# Altium schematic sheet Illustrations 2.SchDoc: Illustrations 2
size A3; ApprovedBy: LD Stanton; Author: LD Stanton; CompanyName: University of Cape Town; DrawnBy: Lawrence Stanton; Engineer: Lawrence Stanton; Organization: University of Cape Town; Address1: Department of Electrical Engineering; Address2: Rondebosch; Address3: Cape Town; Address4: South Africa 7701; DocumentNumber: 19; SheetNumber: 19; SheetTotal: 20
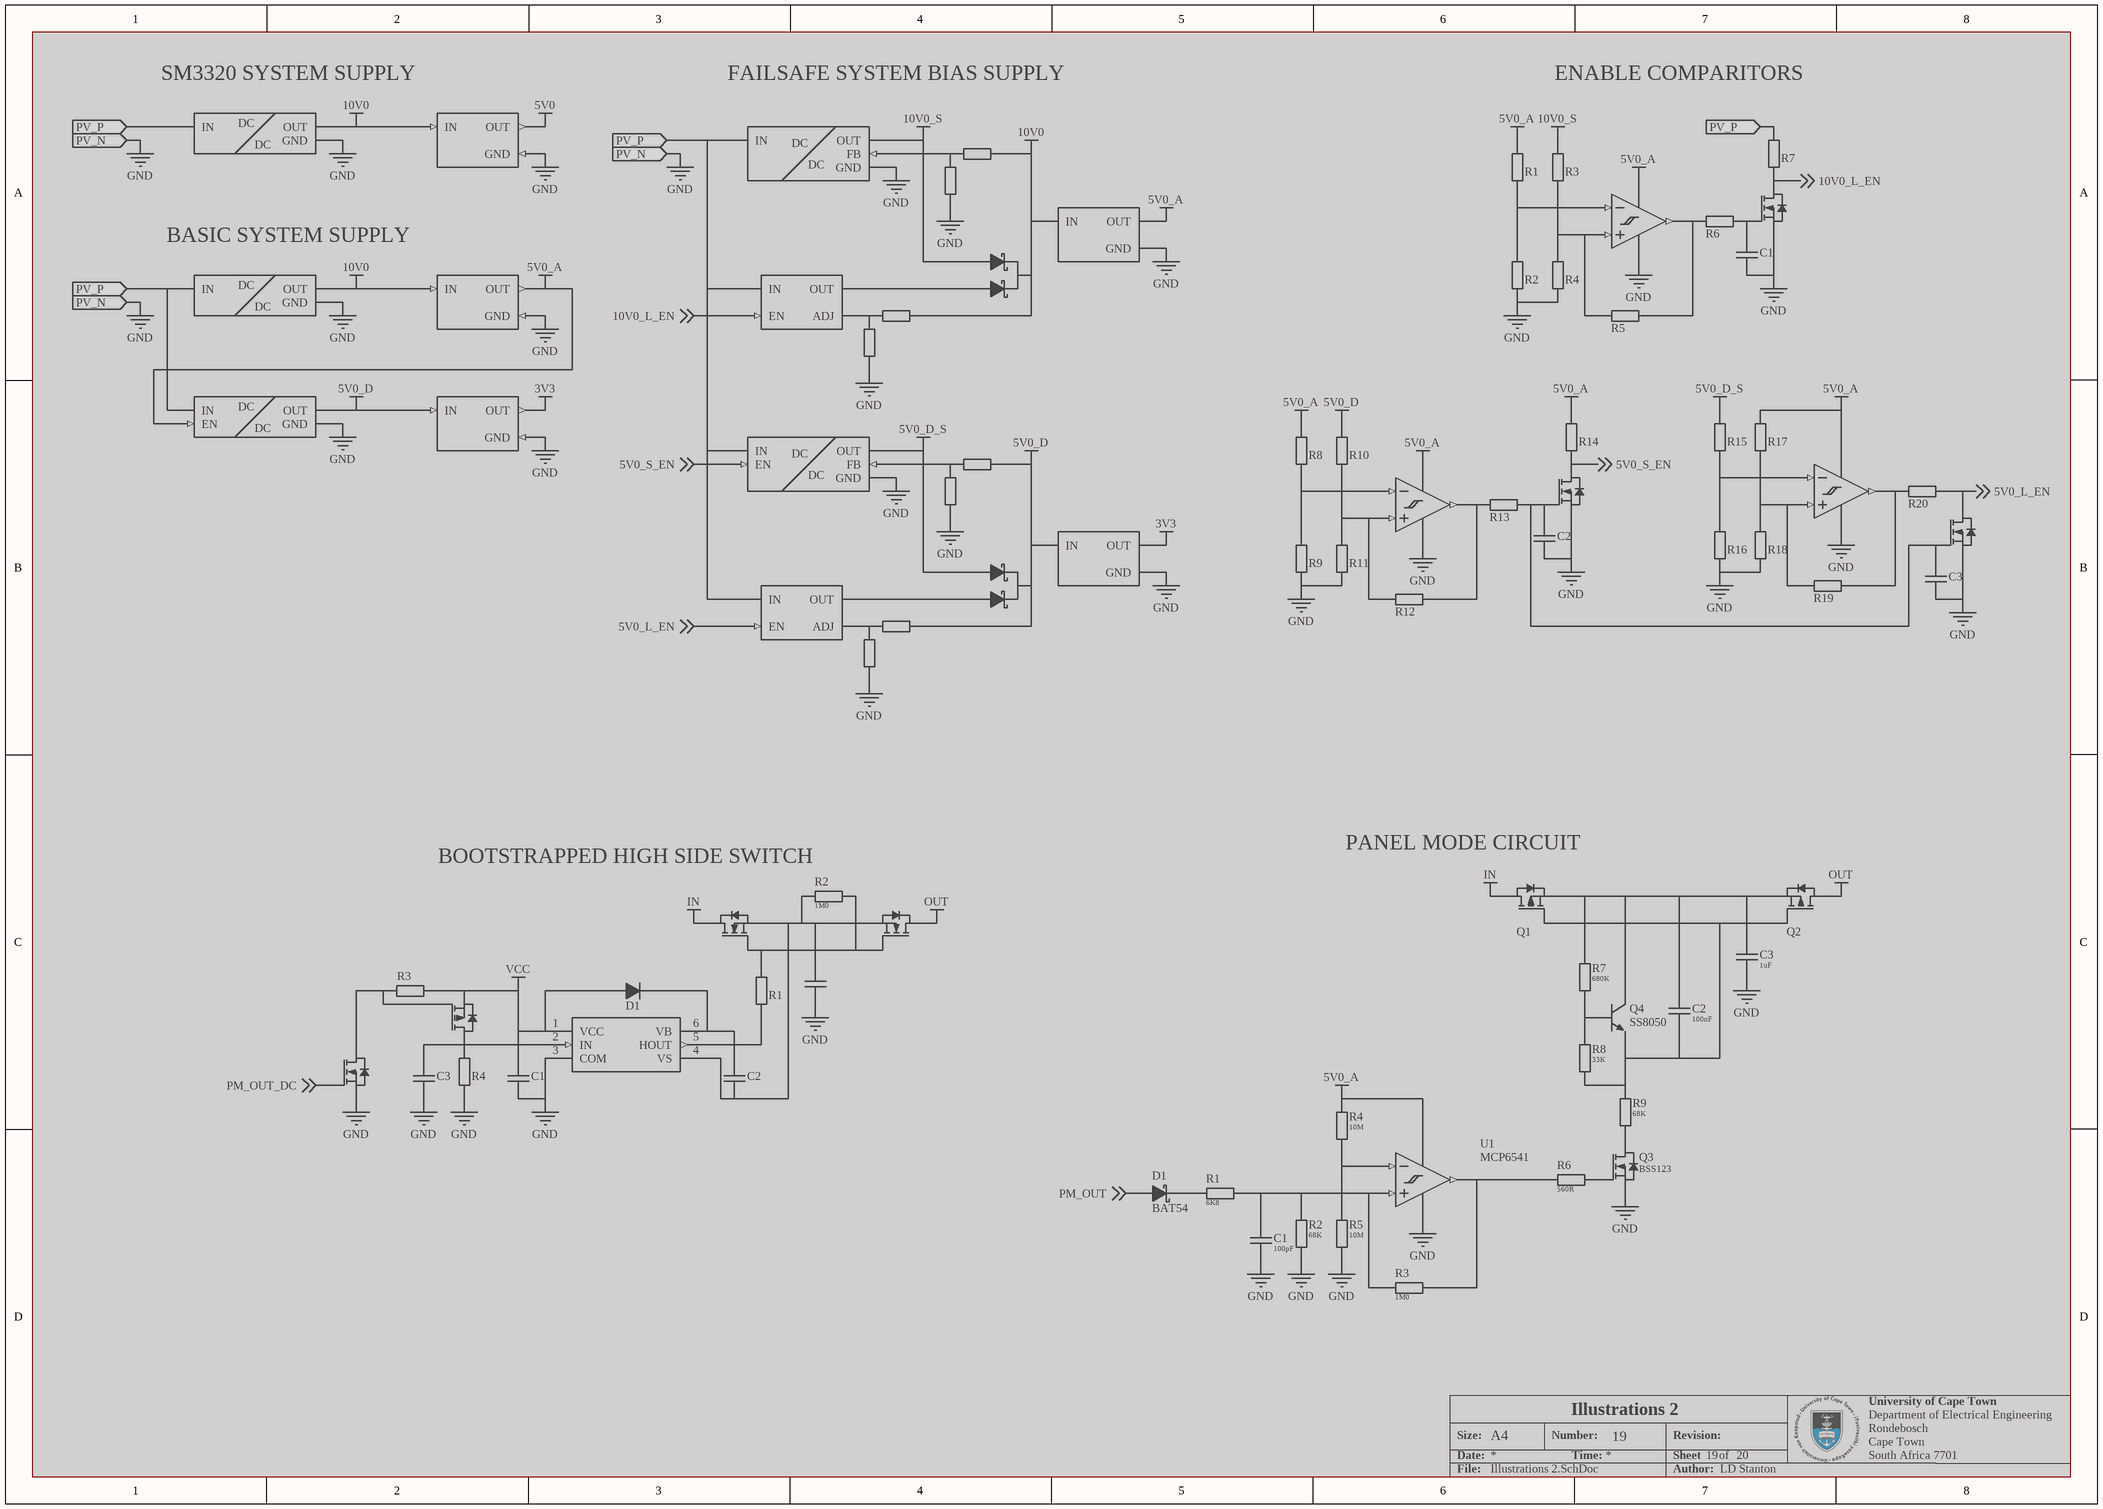
[diagram p0: Illustrations 2.SchDoc]

## Parts
(Parts that share a designator on the sheet are numbered #1, #2 ... from top to bottom, then left to right.)
C1#1  Capacitor Non-Polarised Illustration  (value not drawn)  (graphical)  (masked out: inside a compile mask, not in the netlist)
C1#2  Capacitor Non-Polarised Illustration  (value not drawn)  (graphical)  (masked out: inside a compile mask, not in the netlist)
C1#3  value 100pF  (hidden comment: Capacitor Non-Polarised Illustration)  (graphical)  (masked out: inside a compile mask, not in the netlist)
C2#1  Capacitor Non-Polarised Illustration  (value not drawn)  (graphical)  (masked out: inside a compile mask, not in the netlist)
C2#2  value 100nF  (hidden comment: Capacitor Non-Polarised Illustration)  (graphical)  (masked out: inside a compile mask, not in the netlist)
C2#3  Capacitor Non-Polarised Illustration  (value not drawn)  (graphical)  (masked out: inside a compile mask, not in the netlist)
C3#1  Capacitor Non-Polarised Illustration  (value not drawn)  (graphical)  (masked out: inside a compile mask, not in the netlist)
C3#2  value 1uF  (hidden comment: Capacitor Non-Polarised Illustration)  (graphical)  (masked out: inside a compile mask, not in the netlist)
C3#3  Capacitor Non-Polarised Illustration  (value not drawn)  (graphical)  (masked out: inside a compile mask, not in the netlist)
C3#4  Capacitor Non-Polarised Illustration  (value not drawn)  (graphical)  (masked out: inside a compile mask, not in the netlist)
D1#1  Diode Illustration  (value not drawn)  (graphical)  (masked out: inside a compile mask, not in the netlist)
D1#2  BAT54  (graphical)  (masked out: inside a compile mask, not in the netlist)
D?#1  Schottky Dual Common Cathode Illustration  (value not drawn)  (graphical)  (masked out: inside a compile mask, not in the netlist)
D?#2  Schottky Dual Common Cathode Illustration  (value not drawn)  (graphical)  (masked out: inside a compile mask, not in the netlist)
Q1  MOSFET P-Channel Illustration  (value not drawn)  (graphical)  (masked out: inside a compile mask, not in the netlist)
Q2  MOSFET P-Channel Illustration  (value not drawn)  (graphical)  (masked out: inside a compile mask, not in the netlist)
Q3  BSS123  (graphical)  (masked out: inside a compile mask, not in the netlist)
Q4  SS8050  (graphical)  (masked out: inside a compile mask, not in the netlist)
Q?#1  MOSFET N-Channel Illustration  (value not drawn)  (graphical)  (masked out: inside a compile mask, not in the netlist)
Q?#2  MOSFET N-Channel Illustration  (value not drawn)  (graphical)  (masked out: inside a compile mask, not in the netlist)
Q?#3  MOSFET N-Channel Illustration  (value not drawn)  (graphical)  (masked out: inside a compile mask, not in the netlist)
Q?#4  MOSFET N-Channel Illustration  (value not drawn)  (graphical)  (masked out: inside a compile mask, not in the netlist)
Q?#5  MOSFET N-Channel Illustration  (value not drawn)  (graphical)  (masked out: inside a compile mask, not in the netlist)
Q?#6  MOSFET P-Channel Illustration  (value not drawn)  (graphical)  (masked out: inside a compile mask, not in the netlist)
Q?#7  MOSFET N-Channel Illustration  (value not drawn)  (graphical)  (masked out: inside a compile mask, not in the netlist)
R1#1  Resistor Box Illustration  (value not drawn)  (graphical)  (masked out: inside a compile mask, not in the netlist)
R1#2  Resistor Box Illustration  (value not drawn)  (graphical)  (masked out: inside a compile mask, not in the netlist)
R1#3  value 6K8  (hidden comment: Resistor Box Illustration)  (graphical)  (masked out: inside a compile mask, not in the netlist)
R2#1  Resistor Box Illustration  (value not drawn)  (graphical)  (masked out: inside a compile mask, not in the netlist)
R2#2  value 1M0  (hidden comment: Resistor Box Illustration)  (graphical)  (masked out: inside a compile mask, not in the netlist)
R2#3  value 68K  (hidden comment: Resistor Box Illustration)  (graphical)  (masked out: inside a compile mask, not in the netlist)
R3#1  Resistor Box Illustration  (value not drawn)  (graphical)  (masked out: inside a compile mask, not in the netlist)
R3#2  Resistor Box Illustration  (value not drawn)  (graphical)  (masked out: inside a compile mask, not in the netlist)
R3#3  value 1M0  (hidden comment: Resistor Box Illustration)  (graphical)  (masked out: inside a compile mask, not in the netlist)
R4#1  Resistor Box Illustration  (value not drawn)  (graphical)  (masked out: inside a compile mask, not in the netlist)
R4#2  Resistor Box Illustration  (value not drawn)  (graphical)  (masked out: inside a compile mask, not in the netlist)
R4#3  value 10M  (hidden comment: Resistor Box Illustration)  (graphical)  (masked out: inside a compile mask, not in the netlist)
R5#1  Resistor Box Illustration  (value not drawn)  (graphical)  (masked out: inside a compile mask, not in the netlist)
R5#2  value 10M  (hidden comment: Resistor Box Illustration)  (graphical)  (masked out: inside a compile mask, not in the netlist)
R6#1  Resistor Box Illustration  (value not drawn)  (graphical)  (masked out: inside a compile mask, not in the netlist)
R6#2  value 560R  (hidden comment: Resistor Box Illustration)  (graphical)  (masked out: inside a compile mask, not in the netlist)
R7#1  Resistor Box Illustration  (value not drawn)  (graphical)  (masked out: inside a compile mask, not in the netlist)
R7#2  value 680K  (hidden comment: Resistor Box Illustration)  (graphical)  (masked out: inside a compile mask, not in the netlist)
R8#1  Resistor Box Illustration  (value not drawn)  (graphical)  (masked out: inside a compile mask, not in the netlist)
R8#2  value 33K  (hidden comment: Resistor Box Illustration)  (graphical)  (masked out: inside a compile mask, not in the netlist)
R9#1  Resistor Box Illustration  (value not drawn)  (graphical)  (masked out: inside a compile mask, not in the netlist)
R9#2  value 68K  (hidden comment: Resistor Box Illustration)  (graphical)  (masked out: inside a compile mask, not in the netlist)
R10  Resistor Box Illustration  (value not drawn)  (graphical)  (masked out: inside a compile mask, not in the netlist)
R11  Resistor Box Illustration  (value not drawn)  (graphical)  (masked out: inside a compile mask, not in the netlist)
R12  Resistor Box Illustration  (value not drawn)  (graphical)  (masked out: inside a compile mask, not in the netlist)
R13  Resistor Box Illustration  (value not drawn)  (graphical)  (masked out: inside a compile mask, not in the netlist)
R14  Resistor Box Illustration  (value not drawn)  (graphical)  (masked out: inside a compile mask, not in the netlist)
R15  Resistor Box Illustration  (value not drawn)  (graphical)  (masked out: inside a compile mask, not in the netlist)
R16  Resistor Box Illustration  (value not drawn)  (graphical)  (masked out: inside a compile mask, not in the netlist)
R17  Resistor Box Illustration  (value not drawn)  (graphical)  (masked out: inside a compile mask, not in the netlist)
R18  Resistor Box Illustration  (value not drawn)  (graphical)  (masked out: inside a compile mask, not in the netlist)
R19  Resistor Box Illustration  (value not drawn)  (graphical)  (masked out: inside a compile mask, not in the netlist)
R20  Resistor Box Illustration  (value not drawn)  (graphical)  (masked out: inside a compile mask, not in the netlist)
R?#1  Resistor Box Illustration  (value not drawn)  (graphical)  (masked out: inside a compile mask, not in the netlist)
R?#2  Resistor Box Illustration  (value not drawn)  (graphical)  (masked out: inside a compile mask, not in the netlist)
R?#3  Resistor Box Illustration  (value not drawn)  (graphical)  (masked out: inside a compile mask, not in the netlist)
R?#4  Resistor Box Illustration  (value not drawn)  (graphical)  (masked out: inside a compile mask, not in the netlist)
R?#5  Resistor Box Illustration  (value not drawn)  (graphical)  (masked out: inside a compile mask, not in the netlist)
R?#6  Resistor Box Illustration  (value not drawn)  (graphical)  (masked out: inside a compile mask, not in the netlist)
R?#7  Resistor Box Illustration  (value not drawn)  (graphical)  (masked out: inside a compile mask, not in the netlist)
R?#8  Resistor Box Illustration  (value not drawn)  (graphical)  (masked out: inside a compile mask, not in the netlist)
U1  MCP6541  (graphical)  (masked out: inside a compile mask, not in the netlist)
U?#1  DC/DC Nonisolated Enable Illustration  (value not drawn)  (graphical)  (masked out: inside a compile mask, not in the netlist)
U?#2  Linear Regulator Fixed Illustration  (value not drawn)  (graphical)  (masked out: inside a compile mask, not in the netlist)
U?#3  DC/DC Nonisolated Feedback Illustration  (value not drawn)  (graphical)  (masked out: inside a compile mask, not in the netlist)
U?#4  Comparator Powered Illustration  (value not drawn)  (graphical)  (masked out: inside a compile mask, not in the netlist)
U?#5  Linear Regulator Fixed Illustration  (value not drawn)  (graphical)  (masked out: inside a compile mask, not in the netlist)
U?#6  DC/DC Nonisolated Enable Illustration  (value not drawn)  (graphical)  (masked out: inside a compile mask, not in the netlist)
U?#7  Linear Regulator Fixed Illustration  (value not drawn)  (graphical)  (masked out: inside a compile mask, not in the netlist)
U?#8  Linear Regulator Adjustible Enable Illustration  (value not drawn)  (graphical)  (masked out: inside a compile mask, not in the netlist)
U?#9  DC/DC Nonisolated Enable Illustration  (value not drawn)  (graphical)  (masked out: inside a compile mask, not in the netlist)
U?#10  Linear Regulator Fixed Illustration  (value not drawn)  (graphical)  (masked out: inside a compile mask, not in the netlist)
U?#11  DC/DC Nonisolated Feedback Enable Illustration  (value not drawn)  (graphical)  (masked out: inside a compile mask, not in the netlist)
U?#12  Comparator Powered Illustration  (value not drawn)  (graphical)  (masked out: inside a compile mask, not in the netlist)
U?#13  Comparator Powered Illustration  (value not drawn)  (graphical)  (masked out: inside a compile mask, not in the netlist)
U?#14  Linear Regulator Fixed Illustration  (value not drawn)  (graphical)  (masked out: inside a compile mask, not in the netlist)
U?#15  Linear Regulator Adjustible Enable Illustration  (value not drawn)  (graphical)  (masked out: inside a compile mask, not in the netlist)
U?#16  Gate Driver Illustration  (value not drawn)  (graphical)  (masked out: inside a compile mask, not in the netlist)

## Ports
PV_N (in), PV_P (in)

## Notes on the sheet
- (near U?#1) SM3320 SYSTEM SUPPLY
- FAILSAFE SYSTEM BIAS SUPPLY
- ENABLE COMPARITORS
- (near U?#6) BASIC SYSTEM SUPPLY
- BOOTSTRAPPED HIGH SIDE SWITCH
- (near Q1) PANEL MODE CIRCUIT
- Size:
- Date:
- A4
- Number:
- Time:
- Revision:
- Sheet
- of
- File:
- Author:
- (in symbol CMP-00058-3) DC
- (in symbol CMP-00059-1) DC
- (in symbol CMP-00061-1) DC
- (in symbol CMP-00062-1) DC

## Library data of the parts
C1#1 C1#2 C2#1 C2#3 C3#1 C3#3 C3#4 = CMP-000003-10: Non-Polarised Capacitor for Illustration.; Value: 0F; Tolerance: ±0%; Temperature Coefficient: ±0ppm/K; Placement: CRITICAL; Voltage: 0V; Package: 0000; Temperature: -0 - 0°C
C1#3 C2#2 C3#2 = CMP-000003-10: Non-Polarised Capacitor for Illustration.; Tolerance: ±0%; Temperature Coefficient: ±0ppm/K; Placement: CRITICAL; Voltage: 0V; Package: 0000; Temperature: -0 - 0°C
D1#1 = CMP-00005-4: General Diode for Ilustration; Forward Voltage: 0V0; Placement: CRITICAL; Forward Current: 0A0; Temperature: -0 - 0°C; Blocking Voltage: 0V0
D1#2 = CMP-00003-5: Schottky Diode for Ilustration; Forward Current: 0A0; Placement: CRITICAL; Blocking Voltage: 0V0; Temperature: -0 - 0°C; Forward Voltage: 0V0
D?#1 D?#2 = CMP-00060-1: Common Cathode Schottky Diode Pair for Ilustration; Forward Voltage: 0V0; Placement: CRITICAL; Forward Current: 0A0; Blocking Voltage: 0V0; Temperature: -0 - 0°C
Q1 Q2 Q?#6 = CMP-00001-3: P-Channel MOSFET 3-Terminal for Illustration; Drain-Source Voltage: 0V; Current: 0A; Placement: CRITICAL; Gate-Source Voltage: 0V; Gate Threshold Voltage: 0V; Temperature: -0 - 0°C
Q3 Q?#1-Q?#5 Q?#7 = CMP-000008-5: N-Channel MOSFET 3-Terminal for Illustration; Current: 0A; Gate Threshold Voltage: 0V; Placement: CRITICAL; Temperature: -0 - 0°C; Gate-Source Voltage: 0V; Drain-Source Voltage: 0V
Q4 = CMP-000010-3: NPN Bipolar Junction Transistor for Illustration; Collector Current: 0A; Collector-Emitter Voltage: 0V; Power: 0W; Placement: CRITICAL; Temperature: -0 - 0°C; Saturation Voltgae: 0V
R1#1 R1#2 R2#1 R3#1 R3#2 R4#1 R4#2 R5#1 R6#1 R7#1 R8#1 R9#1 R10-R20 R?#1-R?#8 = CMP-010-000360-14: Resistor for Illustration. Box Symbol.; Value: 0K0; Working Voltage: 0V; Power: 0W; Placement: CRITICAL; Tolerance: ±0%; Temperature Coefficient: ±0ppm/K; Package: 0000; Temperature: -0 - 0°C
R1#3 R2#2 R2#3 R3#3 R4#3 R5#2 R6#2 R7#2 R8#2 R9#2 = CMP-010-000360-14: Resistor for Illustration. Box Symbol.; Working Voltage: 0V; Power: 0W; Placement: CRITICAL; Tolerance: ±0%; Temperature Coefficient: ±0ppm/K; Package: 0000; Temperature: -0 - 0°C
U1 U?#4 U?#12 U?#13 = CMP-00063-3: Comparator with Power Pins for Illustration; Placement: CRITICAL; Temperature: -0 - 0°C
U?#1 U?#6 = CMP-00059-1: Nonisolated DC/DC Converter with Enable for Illustration; Placement: CRITICAL
U?#2 U?#7 U?#10 = CMP-00057-1: Fixed Linear Regulator for Illustration; Placement: CRITICAL
U?#3 = CMP-00062-1: Nonisolated DC/DC Converter with Feedback for Illustration; Placement: CRITICAL
U?#5 U?#14 = CMP-00057-3: Fixed Linear Regulator for Illustration; Placement: CRITICAL
U?#8 U?#15 = CMP-00055-3: Adjustible Linear Regulator with Enable for Illustration; Placement: CRITICAL
U?#9 = CMP-00058-3: Nonisolated DC/DC Converter with Enable for Illustration; Placement: CRITICAL
U?#11 = CMP-00061-1: Nonisolated DC/DC Converter with Feedback and Enable for Illustration; Placement: CRITICAL
U?#16 = CMP-000027-2: Simple Gate Driver IC for Illustration